# Altium schematic sheet hmc830_basic.SchDoc
size A3
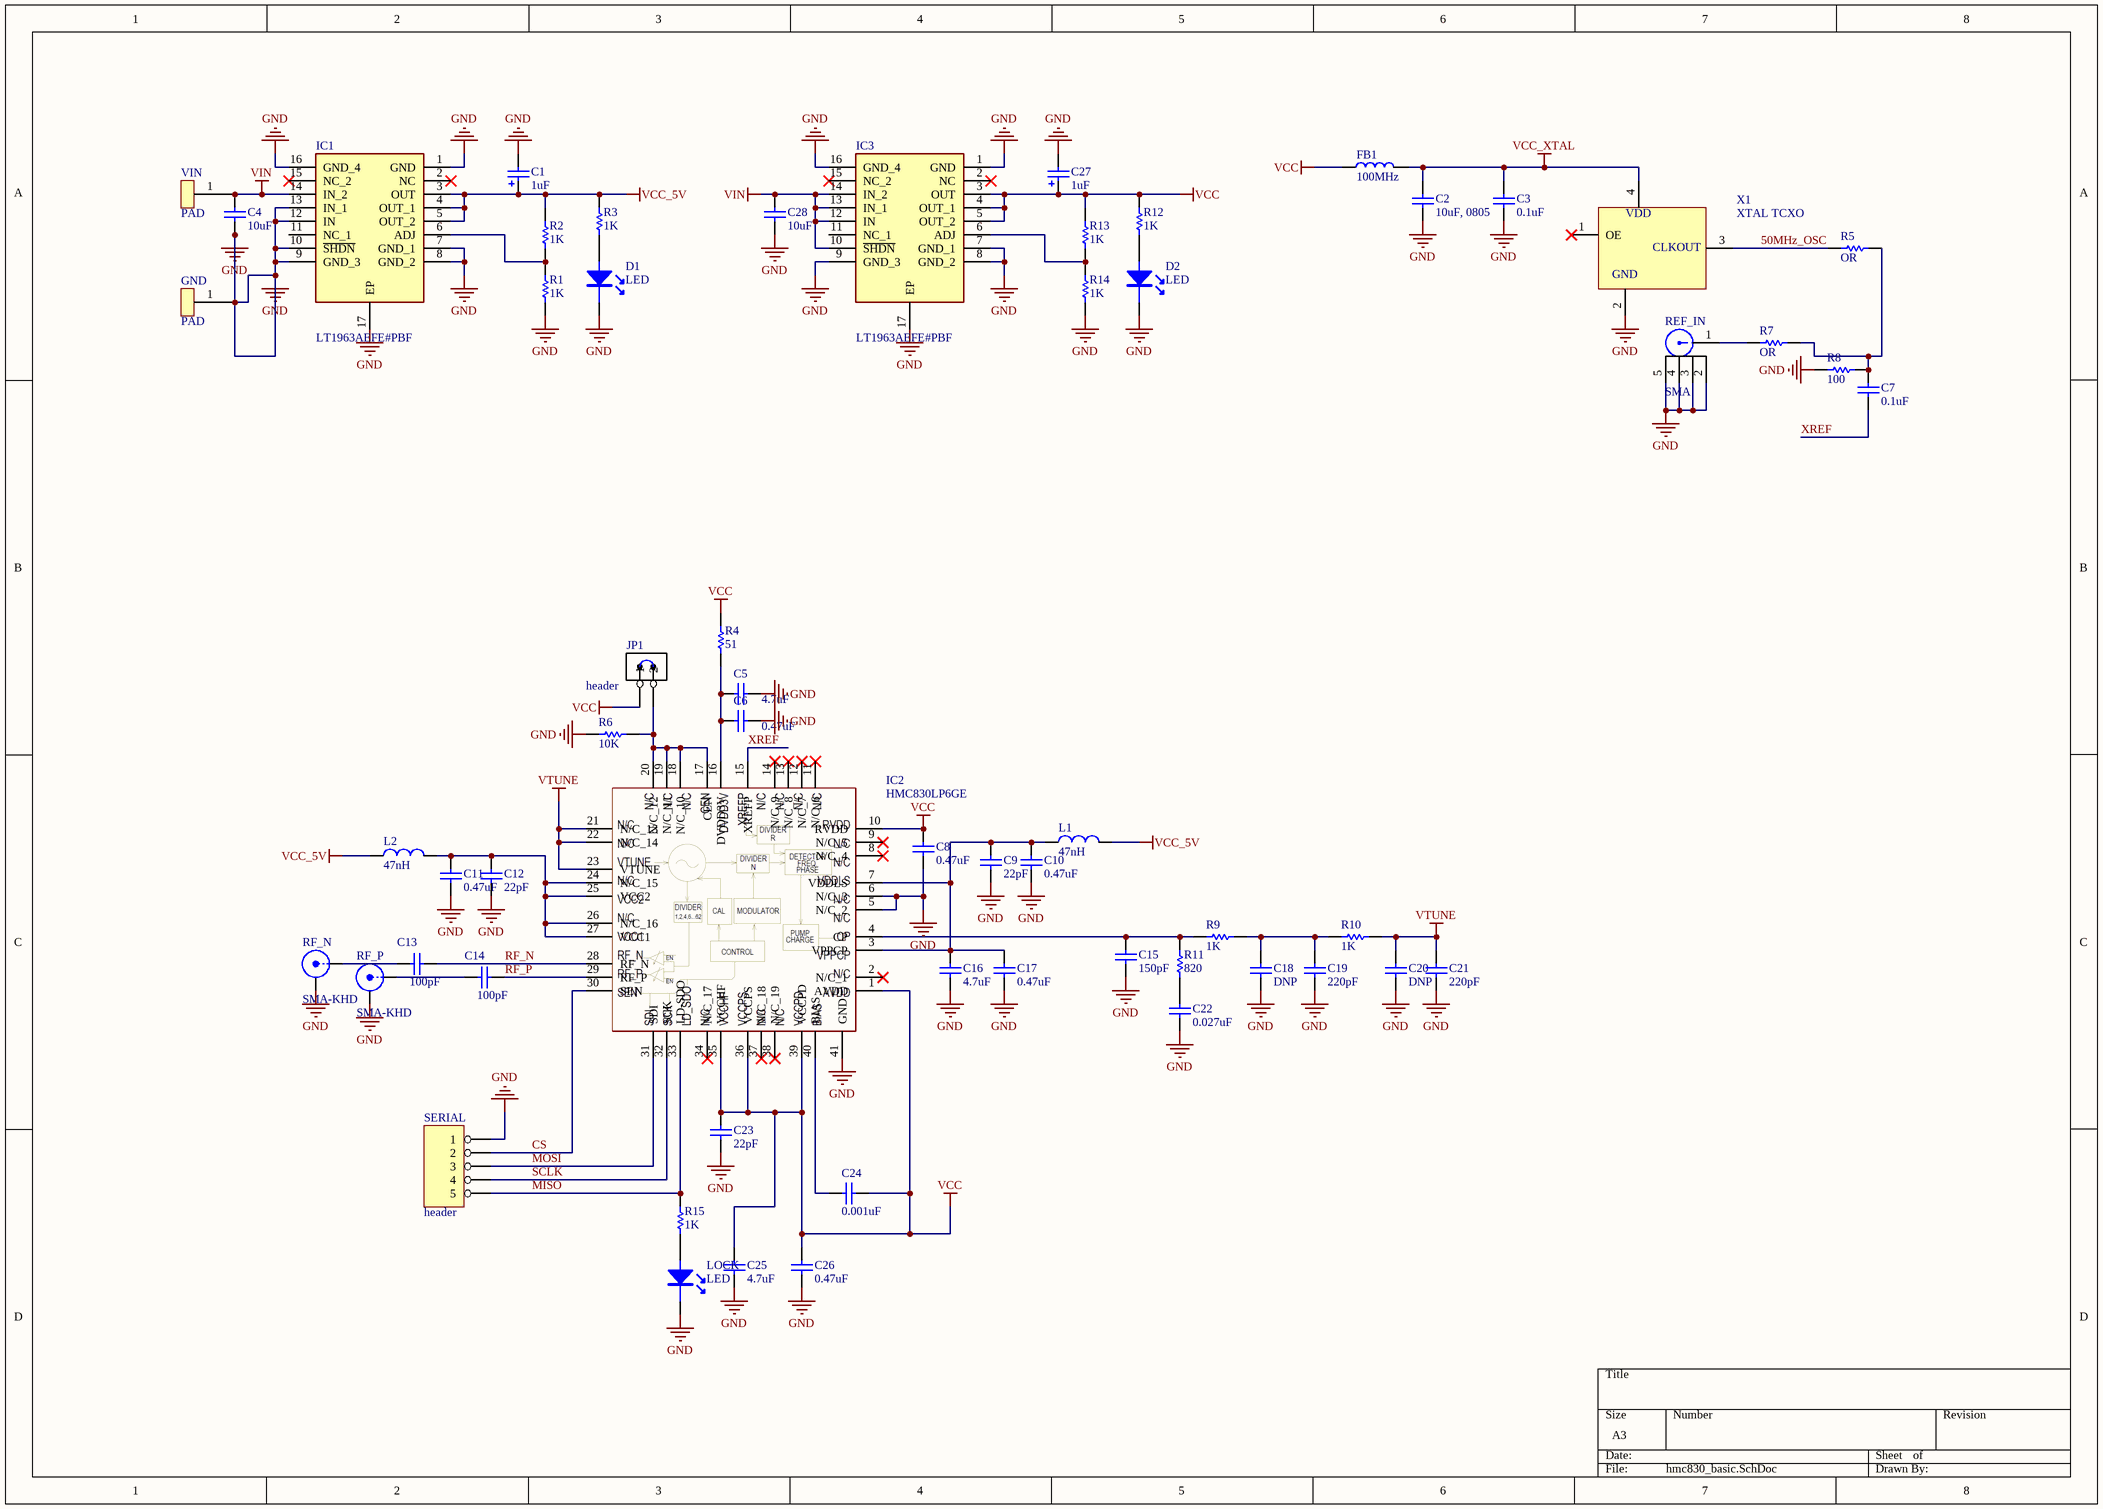
[diagram p0: hmc830_basic.SchDoc]

## Parts
C1  1uF  [CAPC3528B]
C2  10uF, 0805  [0805_c]
C3  0.1uF  [0603_C]
C4  10uF  [0805_c]
C5  4.7uF  [0603_C]
C6  0.47uF  [0603_C]
C7  0.1uF  [0603_C]
C8  0.47uF  [0603_C]
C9  22pF  [0603_C]
C10  0.47uF  [0603_C]
C11  0.47uF  [0603_C]
C12  22pF  [0603_C]
C13  100pF  [0603_C]
C14  100pF  [0603_C]
C15  150pF  [0603_C]
C16  4.7uF  [0603_C]
C17  0.47uF  [0603_C]
C18  DNP  [0603_C]
C19  220pF  [0603_C]
C20  DNP  [0603_C]
C21  220pF  [0603_C]
C22  0.027uF  [0603_C]
C23  22pF  [0603_C]
C24  0.001uF  [0603_C]
C25  4.7uF  [0603_C]
C26  0.47uF  [0603_C]
C27  1uF  [CAPC3528B]
C28  10uF  [0805_c]
D1  LED  [0603_LED]
D2  LED  [0603_LED]
FB1  100MHz  [FB0603]
GND  PAD  [PAD]
IC1  LT1963AEFE#PBF  [SOP65P640X110-17N]
IC2  HMC830LP6GE  [QFN50P600X600X90-41N-D]
IC3  LT1963AEFE#PBF  [SOP65P640X110-17N]
JP1  header  [jumper]
L1  47nH  [0603]
L2  47nH  [0603]
LOCK  LED  [0603_LED]
R1  1K  [0603_R]
R2  1K  [0603_R]
R3  1K  [0603_R]
R4  51  [0603_R]
R5  OR  [0603_R]
R6  10K  [0603_R]
R7  OR  [0603_R]
R8  100  [0603_R]
R9  1K  [0603_R]
R10  1K  [0603_R]
R11  820  [0603_R]
R12  1K  [0603_R]
R13  1K  [0603_R]
R14  1K  [0603_R]
R15  1K  [0603_R]
REF_IN  SMA  [SMA-KE]  (graphical)
RF_N  SMA-KHD  [SMA-2]
RF_P  SMA-KHD  [SMA-2]
SERIAL  header  [header5]
VIN  PAD  [PAD]
X1  XTAL TCXO  [OSC_KH3225_4P]

## Nets
GND: C1.2 C2.1 C3.1 C4.1 C5.2 C6.2 C8.1 C9.1 C10.1 C11.1 C12.1 C15.1 C16.1 C17.1 C18.1 C19.1 C20.1 C21.1 C22.1 C23.1 C25.1 C26.1 C27.2 C28.1 D1.2(K) D2.2(K) GND.1 IC1.1(GND) IC1.7(GND_1) IC1.8(GND_2) IC1.9(GND_3) IC1.10(~{SHDN}) IC1.12(IN) IC1.13(IN_1) IC1.16(GND_4) IC1.17(EP) IC2.5(N/C_2) IC2.6(N/C_3) IC2.41(GND) IC3.1(GND) IC3.7(GND_1) IC3.8(GND_2) IC3.9(GND_3) IC3.16(GND_4) IC3.17(EP) LOCK.2(K) R1.1 R6.1 R8.2 R14.1 REF_IN.2(GND) REF_IN.3(GND) REF_IN.4(GND) REF_IN.5(GND) RF_N.1(Y) RF_P.1(Y) SERIAL.1 X1.2(GND)
VCC: C8.2 C23.2 C24.1 C25.2 C26.2 C27.1 FB1.1 IC2.1(AVDD) IC2.10(RVDD) IC2.35(VCCHF) IC2.36(VCCPS) IC2.39(VCCPD) IC3.3(OUT) IC3.4(OUT_1) IC3.5(OUT_2) JP1.1 R4.2 R12.2 R13.2
VCC_5V: C1.1 IC1.3(OUT) IC1.4(OUT_1) IC1.5(OUT_2) L1.1 L2.1 R2.2 R3.2
VCC_XTAL: C2.2 C3.2 FB1.2 X1.4(VDD)
VIN: C4.2 C28.2 IC1.14(IN_2) IC3.10(~{SHDN}) IC3.12(IN) IC3.13(IN_1) IC3.14(IN_2) VIN.1
VTUNE: C20.2 C21.2 IC2.21(N/C_13) IC2.22(N/C_14) IC2.23(VTUNE) R10.2
50MHz_OSC: R5.2 X1.3(CLK_OUT)
CS: IC2.30(SEN) SERIAL.2
MISO: IC2.33(LD-SDO) R15.2 SERIAL.5
MOSI: IC2.31(SDI) SERIAL.3
RF_N: C13.2 IC2.28(RF_N)
RF_P: C14.2 IC2.29(RF_P)
SCLK: IC2.32(SCK) SERIAL.4
XREF: C7.1 IC2.15(XREFP)
NetC5_1: C5.1 C6.1 IC2.16(DVDD3V) R4.1
NetC7_2: C7.2 R5.1 R7.1 R8.1
NetC9_2: C9.2 C10.2 C16.2 C17.2 IC2.3(VPPCP) IC2.7(VDDLS) L1.2
NetC11_2: C11.2 C12.2 IC2.24(N/C_15) IC2.25(VCC2) IC2.26(N/C_16) IC2.27(VCC1) L2.2
NetC13_1: C13.1 RF_N.2(X)
NetC14_1: C14.1 RF_P.2(X)
NetC15_2: C15.2 IC2.4(CP) R9.1 R11.2
NetC18_2: C18.2 C19.2 R9.2 R10.1
NetC22_2: C22.2 R11.1
NetC24_2: C24.2 IC2.40(BIAS)
NetD1_1: D1.1(A) R3.1
NetD2_1: D2.1(A) R12.1
NetIC1_6: IC1.6(ADJ) R1.2 R2.1
NetIC2_17: IC2.17(CEN) IC2.18(N/C_10) IC2.19(N/C_11) IC2.20(N/C_12) JP1.2 R6.2
NetIC3_6: IC3.6(ADJ) R13.1 R14.2
NetLOCK_1: LOCK.1(A) R15.1
NetR7_2: R7.2 REF_IN.1(vcc)

Not connected (* = marked no-connect by the designer): IC1 2(NC)* 11(NC_1) 15(NC_2)*; IC2 2(N/C_1)* 8(N/C_4)* 9(N/C_5)* 11(N/C_6)* 12(N/C_7)* 13(N/C_8)* 14(N/C_9)* 34(N/C_17)* 37(N/C_18)* 38(N/C_19)*; IC3 2(NC)* 11(NC_1) 15(NC_2)*; X1 1(OE)*

## Notes on the sheet
- (in symbol xtal_tcxo) CLKOUT

## Library data of the parts
C1 C27 = CAP_tan: Capacitor; Value: 104; Published: 8-Jun-2000; LatestRevisionDate: 17-Jul-2002; LatestRevisionNote: Re-released for DXP Platform.; PackageReference: RAD-0.3; Publisher: Altium Limited
C2-C26 C28 = CAP: Capacitor; Value: 104; Published: 8-Jun-2000; LatestRevisionDate: 17-Jul-2002; LatestRevisionNote: Re-released for DXP Platform.; PackageReference: RAD-0.3; Publisher: Altium Limited
D1 D2 LOCK = LED: LED 发光二极管
FB1 = FB: 磁珠
IC1 IC3 = LT1963AEFE#PBF: Integrated Circuit; Manufacturer_Name: Linear Technology; Datasheet Link: http://cds.linear.com/docs/en/datasheet/1963aff.pdf; Height: 1.1mm; Manufacturer_Part_Number: LT1963AEFE#PBF; Arrow Part Number: LT1963AEFE#PBF; Mouser Part Number: 584-LT1963AEFE#PBF; Mouser Price/Stock: https://www.mouser.com/Search/Refine.aspx?Keyword=584-LT1963AEFE%23PBF
IC2 = HMC830LP6GE: Integrated Circuit; Manufacturer_Name: Analog Devices; Datasheet Link: http://docs-emea.rs-online.com/webdocs/13af/0900766b813af108.pdf; Height: 0.9mm; Manufacturer_Part_Number: HMC830LP6GE; Mouser Part Number: 584-HMC830LP6GE; Mouser Price/Stock: https://www.mouser.com/Search/Refine.aspx?Keyword=584-HMC830LP6GE; RS Part Number: 8626458P; RS Price/Stock: http://uk.rs-online.com/web/p/products/8626458P
JP1 = HEADER 2
L1 L2 = Inductor
R1-R3 R9 R10 R12-R15 = RES0: Resistor; Published: 8-Jun-2000; Revision: July-2002: Re-released for DXP Platform.; Publisher: Altium Limited; Value: 1K
R4-R8 R11 = RES0: Resistor; Value: 1K; Published: 8-Jun-2000; Revision: July-2002: Re-released for DXP Platform.; Publisher: Altium Limited
RF_N RF_P = SMA_KHD
SERIAL = HEADER 5
X1 = xtal_tcxo